# EAGLE schematic RFBoardLayoutGen0_v03.2JK2 (EAGLE 7.5.0)
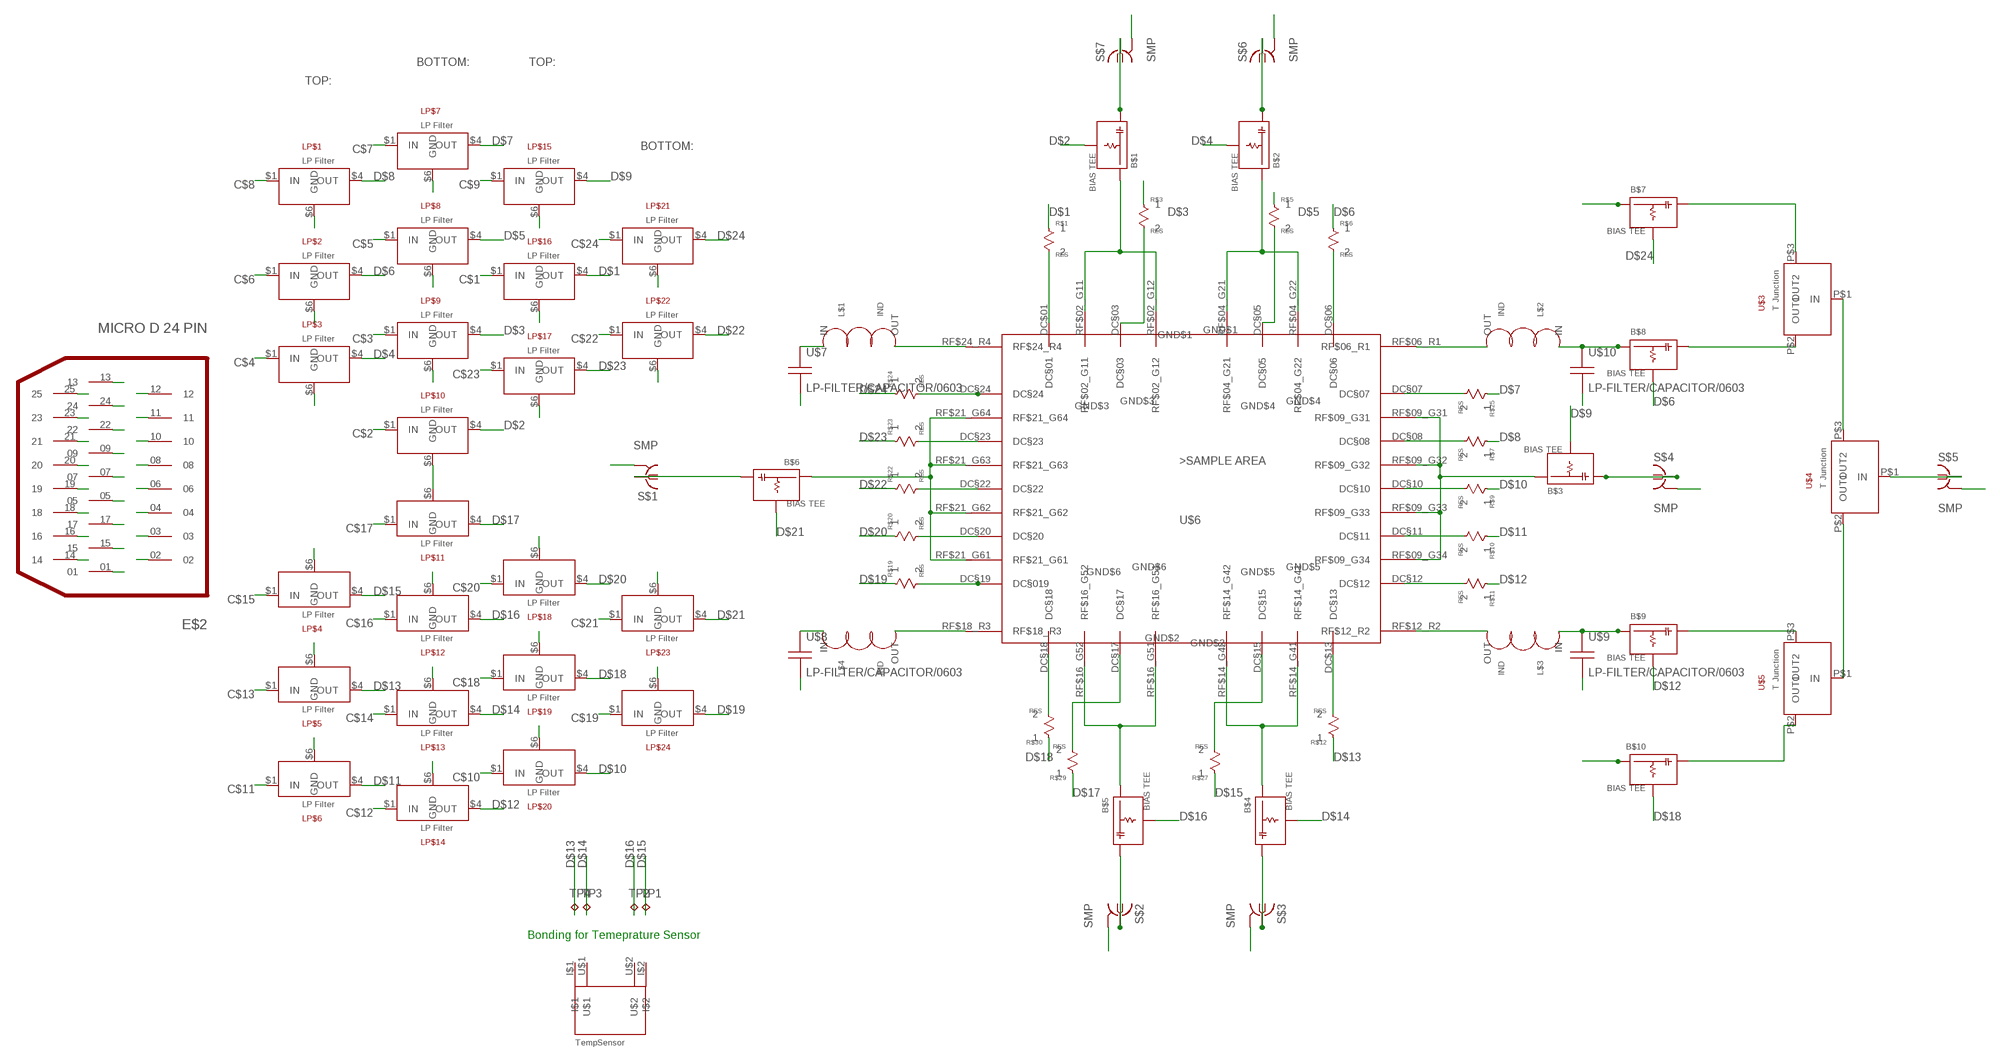
[diagram p0: schematic, sheet 1, part 1 of 2]
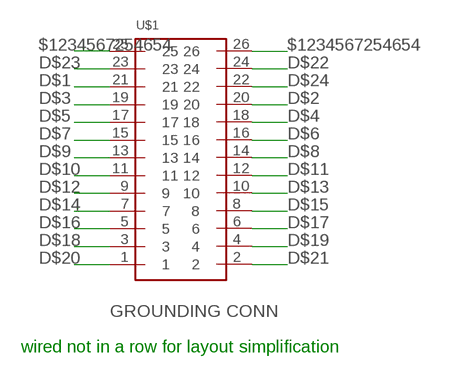
[diagram p1: schematic, sheet 1, part 2 of 2]

## Parts
B$1  BIASTEEDOWN  [BIAS_TEE_DOWN_0603]
B$2  BIASTEEUP  [BIAS_TEE_UP_0603]
B$3  BIASTEEDOWN  [BIAS_TEE_DOWN_0603]
B$4  BIASTEEDOWN  [BIAS_TEE_DOWN_0603]
B$5  BIASTEEUP  [BIAS_TEE_UP_0603]
B$6  BIASTEEDOWN  [BIAS_TEE_DOWN_0603]
B$7  BIASTEEUP  [BIAS_TEE_UP_0603]
B$8  BIASTEEDOWN  [BIAS_TEE_DOWN_0603]
B$9  BIASTEEUP  [BIAS_TEE_UP_0603]
B$10  BIASTEEDOWN  [BIAS_TEE_DOWN_0603]
E$2  25_SOCKET_M83513(13-DPINOUT2  [25_SOCKET_M83513/13-D_V2]
L$1  L_MATCH  [L_MATCH]
L$2  L_MATCH  [L_MATCH]
L$3  L_MATCH  [L_MATCH]
L$4  L_MATCH  [L_MATCH]
LP$1  LP-FILTER/1-STAGETOP  [LP-FILTER/1_STAGE/OS/0603_TOP]
LP$2  LP-FILTER/1-STAGETOP  [LP-FILTER/1_STAGE/OS/0603_TOP]
LP$3  LP-FILTER/1-STAGETOP  [LP-FILTER/1_STAGE/OS/0603_TOP]
LP$4  LP-FILTER/1-STAGETOP  [LP-FILTER/1_STAGE/OS/0603_TOP]
LP$5  LP-FILTER/1-STAGETOP  [LP-FILTER/1_STAGE/OS/0603_TOP]
LP$6  LP-FILTER/1-STAGETOP  [LP-FILTER/1_STAGE/OS/0603_TOP]
LP$7  LP-FILTER/1-STAGEBOT  [LP-FILTER/1_STAGE/OS/0603_BOTTOM]
LP$8  LP-FILTER/1-STAGEBOT  [LP-FILTER/1_STAGE/OS/0603_BOTTOM]
LP$9  LP-FILTER/1-STAGEBOT  [LP-FILTER/1_STAGE/OS/0603_BOTTOM]
LP$10  LP-FILTER/1-STAGEBOT  [LP-FILTER/1_STAGE/OS/0603_BOTTOM]
LP$11  LP-FILTER/1-STAGEBOT  [LP-FILTER/1_STAGE/OS/0603_BOTTOM]
LP$12  LP-FILTER/1-STAGEBOT  [LP-FILTER/1_STAGE/OS/0603_BOTTOM]
LP$13  LP-FILTER/1-STAGEBOT  [LP-FILTER/1_STAGE/OS/0603_BOTTOM]
LP$14  LP-FILTER/1-STAGEBOT  [LP-FILTER/1_STAGE/OS/0603_BOTTOM]
LP$15  LP-FILTER/1-STAGETOP  [LP-FILTER/1_STAGE/OS/0603_TOP]
LP$16  LP-FILTER/1-STAGETOP  [LP-FILTER/1_STAGE/OS/0603_TOP]
LP$17  LP-FILTER/1-STAGETOP  [LP-FILTER/1_STAGE/OS/0603_TOP]
LP$18  LP-FILTER/1-STAGETOP  [LP-FILTER/1_STAGE/OS/0603_TOP]
LP$19  LP-FILTER/1-STAGETOP  [LP-FILTER/1_STAGE/OS/0603_TOP]
LP$20  LP-FILTER/1-STAGETOP  [LP-FILTER/1_STAGE/OS/0603_TOP]
LP$21  LP-FILTER/1-STAGEBOT  [LP-FILTER/1_STAGE/OS/0603_BOTTOM]
LP$22  LP-FILTER/1-STAGEBOT  [LP-FILTER/1_STAGE/OS/0603_BOTTOM]
LP$23  LP-FILTER/1-STAGEBOT  [LP-FILTER/1_STAGE/OS/0603_BOTTOM]
LP$24  LP-FILTER/1-STAGEBOT  [LP-FILTER/1_STAGE/OS/0603_BOTTOM]
R$1  10K  LP-FILTER/RESISTOR/0603  [LP-FILTER/RESISTOR/0603_BOTTOM]
R$3  10K  LP-FILTER/RESISTOR/0603  [LP-FILTER/RESISTOR/0603_BOTTOM]
R$5  10K  LP-FILTER/RESISTOR/0603  [LP-FILTER/RESISTOR/0603_BOTTOM]
R$6  10K  LP-FILTER/RESISTOR/0603  [LP-FILTER/RESISTOR/0603_BOTTOM]
R$7  10K  LP-FILTER/RESISTOR/0603  [LP-FILTER/RESISTOR/0603_BOTTOM]
R$9  10K  LP-FILTER/RESISTOR/0603  [LP-FILTER/RESISTOR/0603_BOTTOM]
R$10  10K  LP-FILTER/RESISTOR/0603  [LP-FILTER/RESISTOR/0603_BOTTOM]
R$11  10K  LP-FILTER/RESISTOR/0603  [LP-FILTER/RESISTOR/0603_BOTTOM]
R$12  10K  LP-FILTER/RESISTOR/0603  [LP-FILTER/RESISTOR/0603_BOTTOM]
R$19  10K  LP-FILTER/RESISTOR/0603  [LP-FILTER/RESISTOR/0603_BOTTOM]
R$20  10K  LP-FILTER/RESISTOR/0603  [LP-FILTER/RESISTOR/0603_BOTTOM]
R$22  10K  LP-FILTER/RESISTOR/0603  [LP-FILTER/RESISTOR/0603_BOTTOM]
R$23  10K  LP-FILTER/RESISTOR/0603  [LP-FILTER/RESISTOR/0603_BOTTOM]
R$24  10K  LP-FILTER/RESISTOR/0603  [LP-FILTER/RESISTOR/0603_BOTTOM]
R$25  10K  LP-FILTER/RESISTOR/0603  [LP-FILTER/RESISTOR/0603_BOTTOM]
R$27  10K  LP-FILTER/RESISTOR/0603  [LP-FILTER/RESISTOR/0603_BOTTOM]
R$29  10K  LP-FILTER/RESISTOR/0603  [LP-FILTER/RESISTOR/0603_BOTTOM]
R$30  10K  LP-FILTER/RESISTOR/0603  [LP-FILTER/RESISTOR/0603_BOTTOM]
S$1  MC-921WIDE  [SMP_STRAIGHT_MINI_WIDE]
S$2  MC-921WIDE  [SMP_STRAIGHT_MINI_WIDE]
S$3  MC-921WIDE  [SMP_STRAIGHT_MINI_WIDE]
S$4  MC-921WIDE  [SMP_STRAIGHT_MINI_WIDE]
S$5  MC-921WIDE  [SMP_STRAIGHT_MINI_WIDE]
S$6  MC-921WIDE  [SMP_STRAIGHT_MINI_WIDE]
S$7  MC-921WIDE  [SMP_STRAIGHT_MINI_WIDE]
TP1  TPTP07SQ  [TP07SQ]
TP2  TPTP07SQ  [TP07SQ]
TP3  TPTP07SQ  [TP07SQ]
TP4  TPTP07SQ  [TP07SQ]
U$1  MEC8-113-02-L-D-RA1MBRD  [MEC8-113-02-L-D-RA1]
U$2  TEMPSENS  [RX-BR_V1]
U$3  TJUNCTION  [T_JUNCTION_0.3MM]
U$4  TJUNCTION  [T_JUNCTION_0.3MM]
U$5  TJUNCTION  [T_JUNCTION_0.3MM]
U$6  24DC+10RF_V2.0  [24DC+10RF/400MU-PADS/0.7X0.7_V2.0]
U$7  LP-FILTER/CAPACITOR/0603  [LP-FILTER/CAPACITOR/0603_BOTTOM]
U$8  LP-FILTER/CAPACITOR/0603  [LP-FILTER/CAPACITOR/0603_BOTTOM]
U$9  LP-FILTER/CAPACITOR/0603  [LP-FILTER/CAPACITOR/0603_BOTTOM]
U$10  LP-FILTER/CAPACITOR/0603  [LP-FILTER/CAPACITOR/0603_BOTTOM]

## Nets
$1234567254654: E$2.25 LP$1.$6(GND) LP$2.$6(GND) LP$3.$6(GND) LP$4.$6(GND) LP$5.$6(GND) LP$6.$6(GND) LP$7.$6(GND) LP$8.$6(GND) LP$9.$6(GND) LP$10.$6(GND) LP$11.$6(GND) LP$12.$6(GND) LP$13.$6(GND) LP$14.$6(GND) LP$15.$6(GND) LP$16.$6(GND) LP$17.$6(GND) LP$18.$6(GND) LP$19.$6(GND) LP$20.$6(GND) LP$21.$6(GND) LP$22.$6(GND) LP$23.$6(GND) LP$24.$6(GND) S$1.2@1(GND) S$1.2@2(GND) S$2.2@1(GND) S$2.2@2(GND) S$3.2@1(GND) S$3.2@2(GND) S$4.2@1(GND) S$4.2@2(GND) S$5.2@1(GND) S$5.2@2(GND) S$6.2@1(GND) S$6.2@2(GND) S$7.2@1(GND) S$7.2@2(GND) U$1.25 U$1.26
C$1: E$2.01 LP$16.$1(IN)
C$2: E$2.02 LP$10.$1(IN)
C$3: E$2.03 LP$9.$1(IN)
C$4: E$2.04 LP$3.$1(IN)
C$5: E$2.05 LP$8.$1(IN)
C$6: E$2.06 LP$2.$1(IN)
C$7: E$2.07 LP$7.$1(IN)
C$8: E$2.08 LP$1.$1(IN)
C$9: E$2.09 LP$15.$1(IN)
C$10: E$2.10 LP$20.$1(IN)
C$11: E$2.11 LP$6.$1(IN)
C$12: E$2.12 LP$14.$1(IN)
C$13: E$2.13 LP$5.$1(IN)
C$14: E$2.14 LP$13.$1(IN)
C$15: E$2.15 LP$4.$1(IN)
C$16: E$2.16 LP$12.$1(IN)
C$17: E$2.17 LP$11.$1(IN)
C$18: E$2.18 LP$19.$1(IN)
C$19: E$2.19 LP$24.$1(IN)
C$20: E$2.20 LP$18.$1(IN)
C$21: E$2.21 LP$23.$1(IN)
C$22: E$2.22 LP$22.$1(IN)
C$23: E$2.23 LP$17.$1(IN)
C$24: E$2.24 LP$21.$1(IN)
D$1: LP$16.$4(OUT) R$1.IN U$1.21
D$2: B$1.LF LP$10.$4(OUT) U$1.20
D$3: LP$9.$4(OUT) R$3.IN U$1.19
D$4: B$2.LF LP$3.$4(OUT) U$1.18
D$5: LP$8.$4(OUT) R$5.IN U$1.17
D$6: B$8.LF LP$2.$4(OUT) R$6.IN U$1.16
D$7: LP$7.$4(OUT) R$25.IN U$1.15
D$8: LP$1.$4(OUT) R$7.IN U$1.14
D$9: B$3.LF LP$15.$4(OUT) U$1.13
D$10: LP$20.$4(OUT) R$9.IN U$1.11
D$11: LP$6.$4(OUT) R$10.IN U$1.12
D$12: B$9.LF LP$14.$4(OUT) R$11.IN U$1.9
D$13: LP$5.$4(OUT) R$12.IN TP4.TP U$1.10
D$14: B$4.LF LP$13.$4(OUT) TP3.TP U$1.7
D$15: LP$4.$4(OUT) R$27.IN TP1.TP U$1.8
D$16: B$5.LF LP$12.$4(OUT) TP2.TP U$1.5
D$17: LP$11.$4(OUT) R$29.IN U$1.6
D$18: B$10.LF LP$19.$4(OUT) R$30.IN U$1.3
D$19: LP$24.$4(OUT) R$19.IN U$1.4
D$20: LP$18.$4(OUT) R$20.IN U$1.1
D$21: B$6.LF LP$23.$4(OUT) U$1.2
D$22: LP$22.$4(OUT) R$22.IN U$1.24
D$23: LP$17.$4(OUT) R$23.IN U$1.23
D$24: B$7.LF LP$21.$4(OUT) R$24.IN U$1.22
DC$1: R$1.OUT U$6.DC$01(DC§01)
DC$3: R$3.OUT U$6.DC§03
DC$5: B$2.OUT U$6.RF$04_G21 U$6.RF$04_G22
DC$6: R$6.OUT U$6.DC§06
DC$10: B$3.OUT U$6.RF$09_G31 U$6.RF$09_G32 U$6.RF$09_G33 U$6.RF$09_G34
DC$13: R$12.OUT U$6.DC$13(DC§13)
DC$15: R$27.OUT U$6.DC§15
DC$19: R$19.OUT U$6.DC§19(DC§019)
DC$20: R$20.OUT U$6.DC§20
DC$24: R$24.OUT U$6.DC§24
GND: U$7.OUT U$8.OUT U$9.OUT U$10.OUT
N$1: B$6.HF S$1.1
N$2: L$3.OUT U$6.RF$12_R2
N$3 [RF]: B$1.OUT U$6.RF$02_G11 U$6.RF$02_G12
N$4: R$25.OUT U$6.DC§07
N$5 [RF]: B$1.HF S$7.1
N$6 [RF]: B$2.HF S$6.1
N$7: B$4.OUT U$6.RF$14_G41 U$6.RF$14_G42
N$8: B$5.OUT U$6.RF$16_G51 U$6.RF$16_G52
N$9 [RF]: L$4.OUT U$6.RF$18_R3
N$10 [RF]: L$1.OUT U$6.RF$24_R4
N$11 [RF]: L$2.OUT U$6.RF$06_R1
N$12: R$7.OUT U$6.DC§08
N$13 [RF]: B$9.OUT L$3.IN U$9.IN
N$14 [RF]: B$8.OUT L$2.IN U$10.IN
N$15 [RF]: B$9.HF U$5.P$3(OUT2)
N$16 [RF]: B$5.HF S$2.1
N$17 [RF]: B$4.HF S$3.1
N$18 [RF]: B$3.HF S$4.1
N$19 [RF]: B$7.HF U$3.P$3(OUT2)
N$20: B$6.OUT U$6.RF$21_G61 U$6.RF$21_G62 U$6.RF$21_G63 U$6.RF$21_G64
N$21 [RF]: S$5.1 U$4.P$1(IN)
N$22 [RF]: B$10.HF U$5.P$2(OUT1)
N$23 [RF]: B$8.HF U$3.P$2(OUT1)
N$24: R$9.OUT U$6.DC§10
N$25 [RF]: U$3.P$1(IN) U$4.P$3(OUT2)
N$26 [RF]: U$4.P$2(OUT1) U$5.P$1(IN)
N$27: R$10.OUT U$6.DC§11
N$28: R$11.OUT U$6.DC§12
N$29: R$5.OUT U$6.DC§05
N$30: R$29.OUT U$6.DC§17
N$31: R$30.OUT U$6.DC§18
N$32: R$22.OUT U$6.DC§22
N$33: R$23.OUT U$6.DC§23
RF$3 [RF]: B$10.OUT L$4.IN U$8.IN
RF$4 [RF]: B$7.OUT L$1.IN U$7.IN
Unconnected: U$2.I$1 U$2.I$2 U$2.U$1 U$2.U$2 U$6.GND$1 U$6.GND$2 U$6.GND$3 U$6.GND$4 U$6.GND$5 U$6.GND$6

## Notes on the sheet
- BOTTOM: | TOP:
- TOP:
- BOTTOM:
- wired not in a row for layout simplification
- Bonding for Temeprature Sensor

## Library data of the parts
B$1-B$10 = Bias tee:BIASTEE
E$2 = Glenair:25_SOCKET_M83513(13-D
L$1-L$4 = MatchCircuit:L_MATCH
LP$1-LP$24 = LPFilter:LP-FILTER/1-STAGE
R$1 R$3 R$5-R$7 R$9-R$12 R$19 R$20 R$22-R$25 R$27 R$29 R$30 = LPFilter:LP-FILTER/RESISTOR/0603
S$1-S$7 = RF Connectors:MC-921: COAX. MICROWAVE CONNECTOR O/D diam 2.1 Source: www.tycoelectronics.com .. Electronics .. ENG_CD_1775146_A2.pdf
TP1-TP4 = testpad:TP: Test pad
U$1 = MEC8-130-02-X-D-RA1:MEC8-113-02-L-D-RA1
U$2 = TempSensors:TEMPSENS
U$3-U$5 = RF layout parts:TJUNCTION
U$6 = SampleArea_new:24DC+10RF_V2.0
U$7-U$10 = LPFilter:LP-FILTER/CAPACITOR/0603

## Net classes
0 GND: clearance 0.15 mm
1 RF: clearance 2 mm